# EAGLE design RTD_circuit (EAGLE 9.6.2)
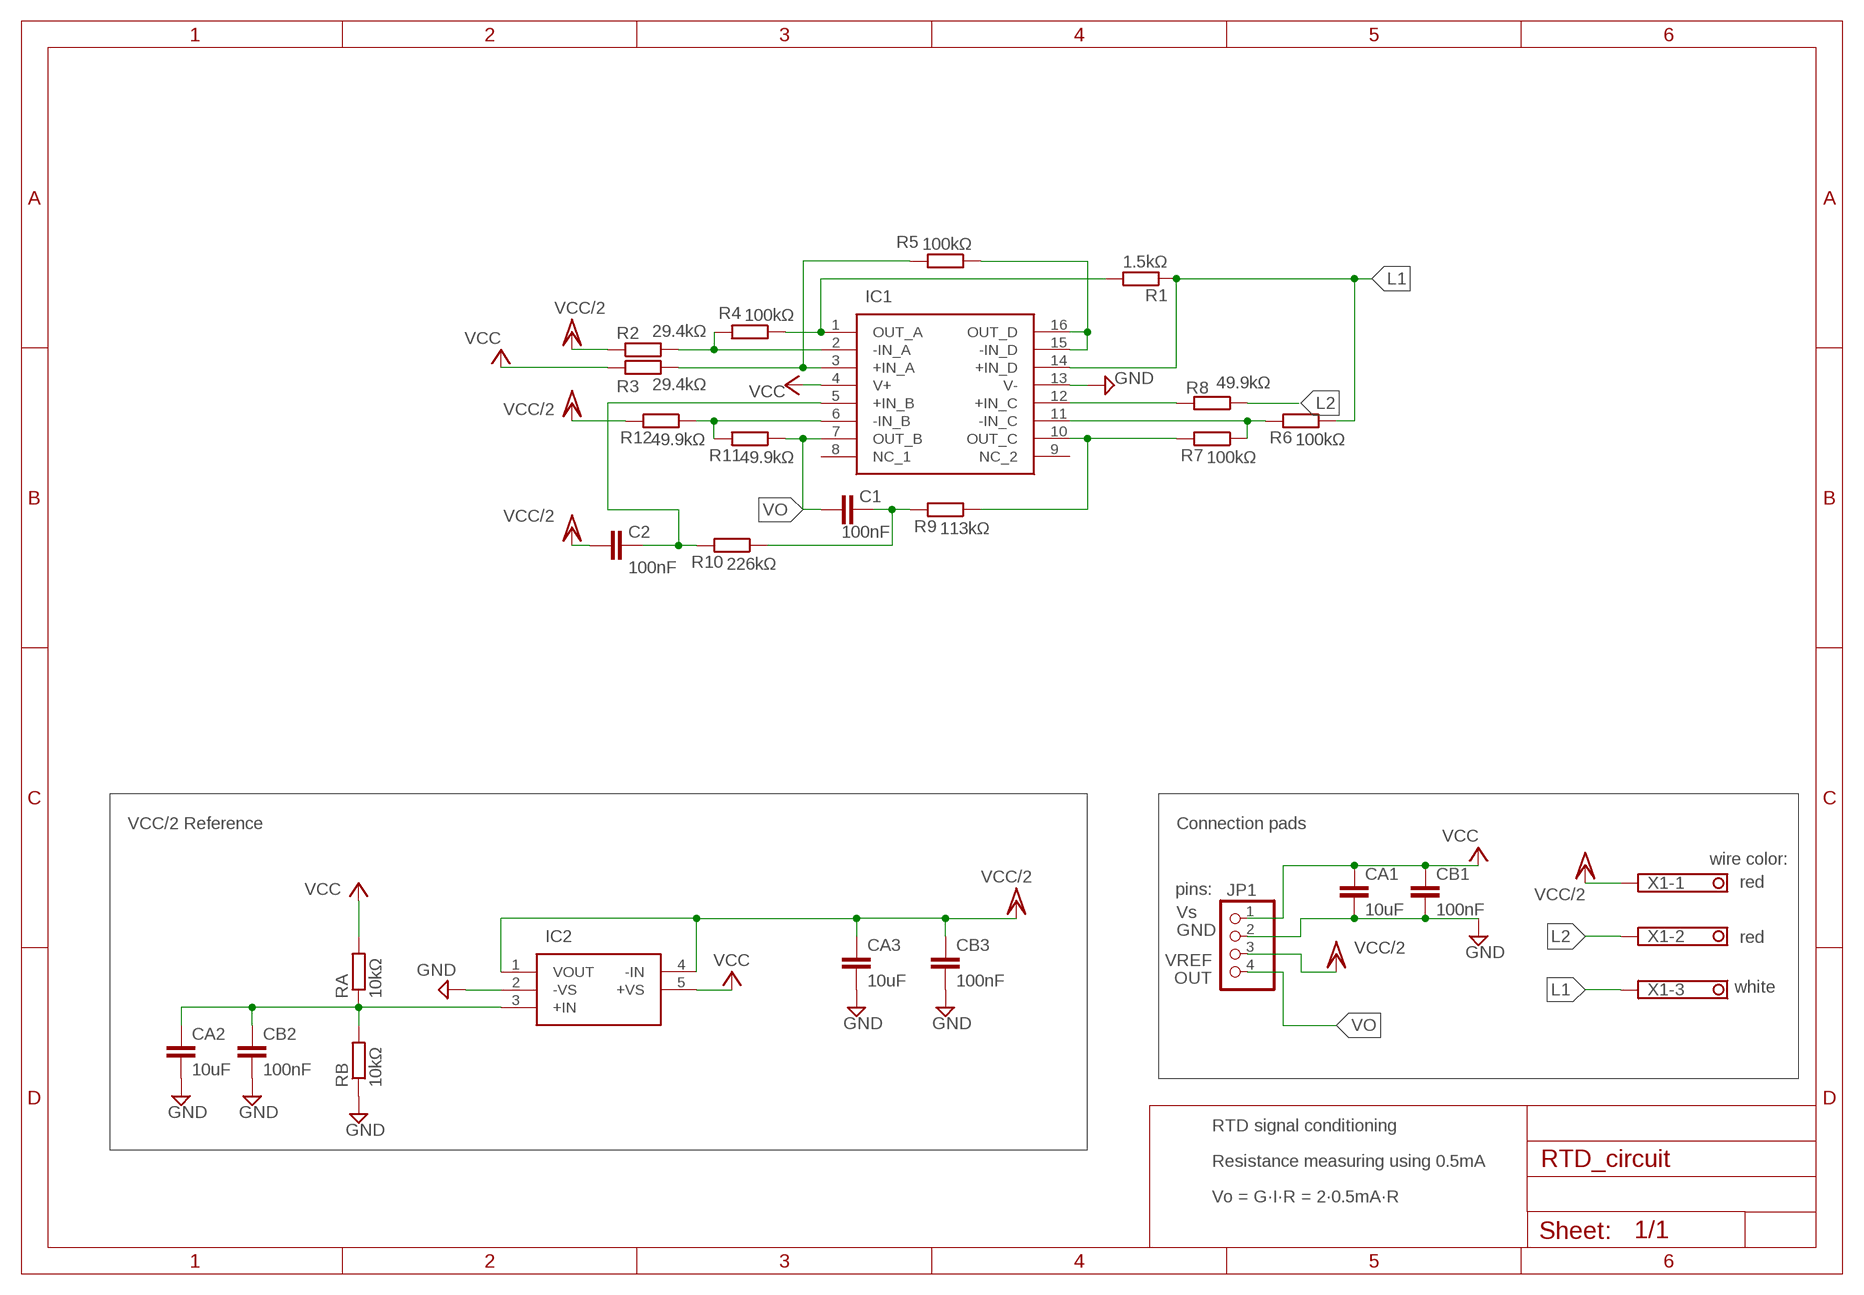
[diagram p0: schematic, sheet 1]

## Parts
C1  100nF  C-EUC0603  [C0603]
C2  100nF  C-EUC0603  [C0603]
CA1  10uF  C-EUC0603  [C0603]
CA2  10uF  C-EUC0603  [C0603]
CA3  10uF  C-EUC0603  [C0603]
CB1  100nF  C-EUC0603  [C0603]
CB2  100nF  C-EUC0603  [C0603]
CB3  100nF  C-EUC0603  [C0603]
IC1  LT1079SW#PBF  [SOIC127P1032X264-16N]
IC2  AD8031ARTZ-R2  [SOT95P280X145-5N]
JP1  PINHD-1X4  [1X04]
R1  1.5kΩ  R-EU_R0603  [R0603]
R2  29.4kΩ  R-EU_R0603  [R0603]
R3  29.4kΩ  R-EU_R0603  [R0603]
R4  100kΩ  R-EU_R0603  [R0603]
R5  100kΩ  R-EU_R0603  [R0603]
R6  100kΩ  R-EU_R0603  [R0603]
R7  100kΩ  R-EU_R0603  [R0603]
R8  49.9kΩ  R-EU_R0603  [R0603]
R9  113kΩ  R-EU_R0603  [R0603]
R10  226kΩ  R-EU_R0603  [R0603]
R11  49.9kΩ  R-EU_R0603  [R0603]
R12  49.9kΩ  R-EU_R0603  [R0603]
RA  10kΩ  R-EU_R0603  [R0603]
RB  10kΩ  R-EU_R0603  [R0603]
X1  1751251  [1751251]

## Nets
DIVIDER: CA2.1 CB2.1 IC2.3(+IN) RA.1 RB.2
GND: CA1.2 CA2.2 CA3.2 CB1.2 CB2.2 CB3.2 IC1.13(V-) IC2.2(-VS) JP1.2 RB.1
L1: IC1.14(+IN_D) R1.1 R6.1 X1.3
L2: R8.1 X1.2
N$1: IC1.12(+IN_C) R8.2
N$3: IC1.6(-IN_B) R11.2 R12.1
N$4: IC1.3(+IN_A) R3.2 R5.2
N$7: IC1.2(-IN_A) R2.2 R4.2
N$8: IC1.1(OUT_A) R1.2 R4.1
N$9: IC1.11(-IN_C) R6.2 R7.1
N$10: IC1.15(-IN_D) IC1.16(OUT_D) R5.1
N$11: IC1.10(OUT_C) R7.2 R9.1
N$12: C1.1 R9.2 R10.1
N$14: C2.1 IC1.5(+IN_B) R10.2
VCC: CA1.1 CB1.1 IC1.4(V+) IC2.5(+VS) JP1.1 R3.1 RA.2
VCC/2: C2.2 CA3.1 CB3.1 IC2.1(VOUT) IC2.4(-IN) JP1.3 R2.1 R12.2 X1.1
VO: C1.2 IC1.7(OUT_B) JP1.4 R11.1
Unconnected: IC1.8(NC_1) IC1.9(NC_2)

## Notes on the sheet
- VCC/2 Reference | Connection pads
- wire color:
- pins:
- red
- Vs
- GND
- red
- VREF
- OUT
- white
- RTD signal conditioning
- Resistance measuring using 0.5mA
- Vo = G·I·R = 2·0.5mA·R

## Library data of the parts
C1 C2 CA1-CA3 CB1-CB3 = rcl:C-EU: CAPACITOR, European symbol; SPICEPREFIX: C
IC1 = RTD_lib:LT1079SW#PBF: Linear Technology LT1079SW#PBF, Quad Precision Op Amp, 200kHz, 5 V, 16-Pin Source: Datasheet <https://componentsearchengine.com/Datasheets/2/LT1079SW#PBF.pdf>; DESCRIPTION: Linear Technology LT1079SW#PBF, Quad Precision Op Amp, 200kHz, 5 V, 16-Pin; HEIGHT: 2.642mm; MANUFACTURER_NAME: Linear Technology; MANUFACTURER_PART_NUMBER: LT1079SW#PBF; MOUSER_PART_NUMBER: 584-LT1079SW#PBF; MOUSER_PRICE-STOCK: https://www.mouser.co.uk/ProductDetail/Analog-Devices-Linear-Technology/LT1079SWPBF?qs=ytflclh7QUUhPHjSTuo8Sw%3D%3D
IC2 = RTD_lib:AD8031ARTZ-R2: Operational Amplifiers - Op Amps SOT23 SINGLE LOW POWER OP AMP 2.7 V, 800 uA, 80 MHz Rail-to-Rail I/O Amplifiers Source: Datasheet <https://www.analog.com/media/en/technical-documentation/data-sheets/AD8031_8032.pdf>; DESCRIPTION: Operational Amplifiers - Op Amps SOT23 SINGLE LOW POWER OP AMP 2.7 V, 800 uA, 80 MHz Rail-to-Rail I/O Amplifiers; HEIGHT: 1.45mm; MANUFACTURER_NAME: Analog Devices; MANUFACTURER_PART_NUMBER: AD8031ARTZ-R2; MOUSER_PART_NUMBER: 584-AD8031ARTZ-R2; MOUSER_PRICE-STOCK: https://www.mouser.co.uk/ProductDetail/Analog-Devices/AD8031ARTZ-R2?qs=Lds8L0UsNW6xZEKTQ5Dviw%3D%3D
JP1 = pinhead:PINHD-1X4: PIN HEADER
R1-R12 RA RB = rcl:R-EU_: RESISTOR, European symbol; SPICEPREFIX: R
X1 = con-phoenix-350:1751251: MKDS 1/ 3-3,5 Printklemme Nennstrom: 10 A Bemessungsspannung: 160 V Raster: 3,5 mm Polzahl: 3 Montageart: Löten Anschlussart: Schraubanschluss Anschlussrichtung vom Leiter zur Platine: 0° Source: http://eshop.phoenixcontact.com .. 1751251.pdf; OC_FARNELL: unknown; OC_NEWARK: unknown

## Board
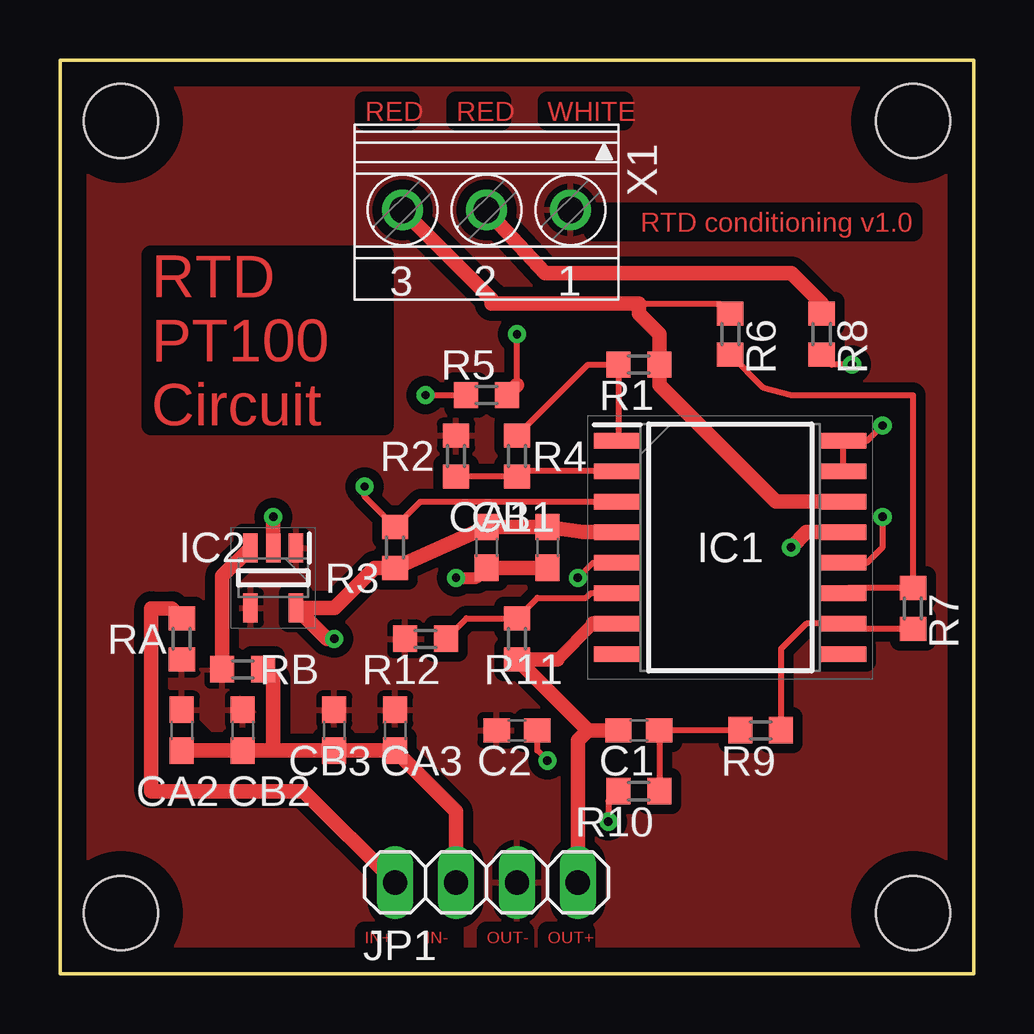
[diagram p1: board, top side]
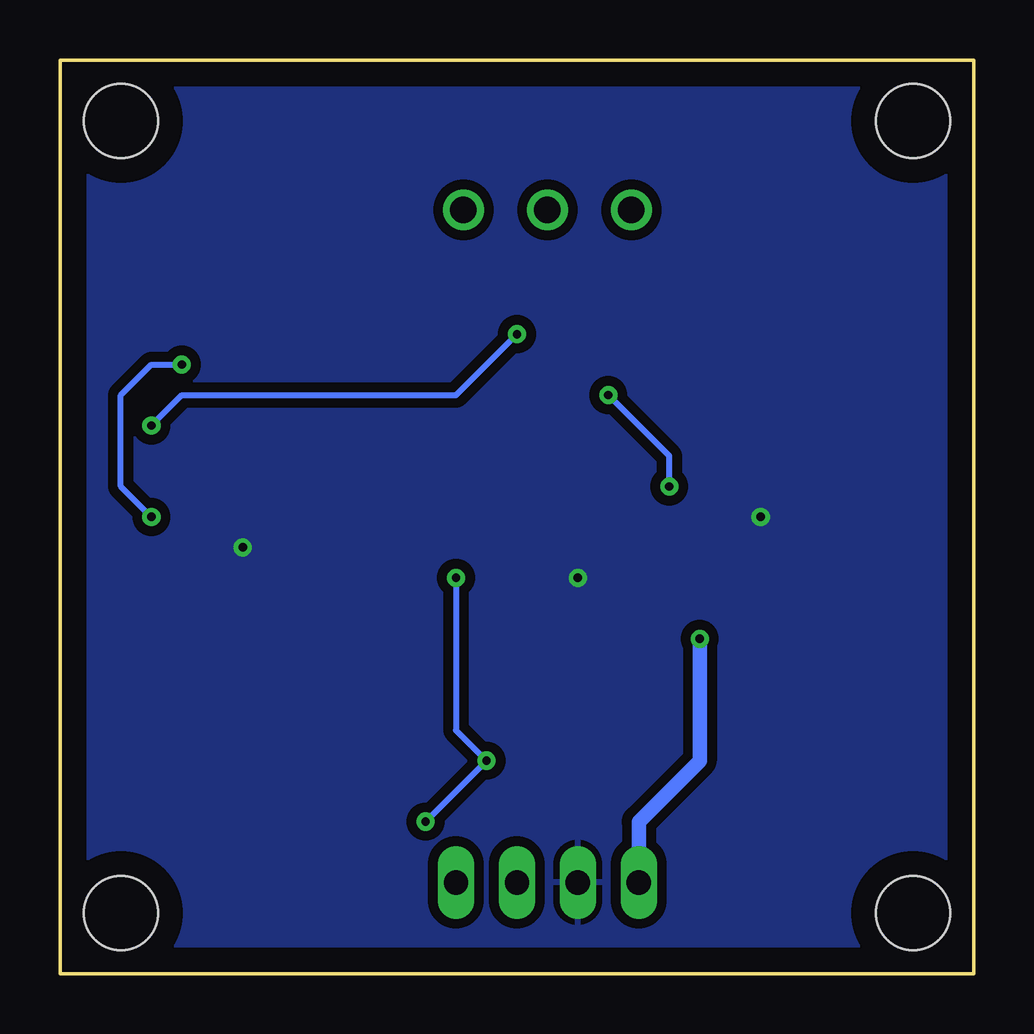
[diagram p2: board, bottom side, seen from below]

Size 38.1 x 38.1 mm. Coordinates in mm from the lower left corner, seen from the top.
Outline: 0,38.1 0,0 38.1,0 38.1,38.1 0,38.1
Copper layers (1*16): Top 0.035mm / dielectric 1.5mm / Bottom 0.035mm
Design rules "default *": minimum track width 1mil, minimum drill 0.35mm, track to track 6mil, track to pad 6mil, pad to pad 6mil, via to via 6mil, smd to smd 6mil, copper to edge 40mil, drill to drill 6mil, minimum pad ring 10mil, minimum via ring 8mil, stop-mask expansion 4mil, vias tented up to drill 0mil, thermal gap 10mil
Holes 3.1 mm at 2.54,35.56 2.54,2.54 35.56,35.56 35.56,2.54

### Footprints (pad centres in the part's own frame; a part is rotated, then mirrored left to right if it is on the bottom)
C0603 = smd 1.1 x 1: 1 -0.85,0; 2 0.85,0
SOIC127P1032X264-16N = smd 1.928 x 0.65: 1 -4.711,4.445; 2 -4.711,3.175; 3 -4.711,1.905; 4 -4.711,0.635; 5 -4.711,-0.635; 6 -4.711,-1.905; 7 -4.711,-3.175; 8 -4.711,-4.445; 9 4.711,-4.445; 10 4.711,-3.175; 11 4.711,-1.905; 12 4.711,-0.635; 13 4.711,0.635; 14 4.711,1.905; 15 4.711,3.175; 16 4.711,4.445
SOT95P280X145-5N = smd 1.2 x 0.6: 1 -1.25,0.95; 2 -1.25,0; 3 -1.25,-0.95; 4 1.25,-0.95; 5 1.25,0.95
1X04 = drill 1.016 long: 1 -3.81,0; 2 -1.27,0; 3 1.27,0; 4 3.81,0
R0603 = smd 1 x 1.1: 1 -0.85,0; 2 0.85,0
1751251 = drill 1.1 pad 1.7: 1 -3.5,-0.1; 2 0,-0.1; 3 3.5,-0.1

### Placement (x,y rotation side)
C1  24.13,10.16 180 top
C2  19.05,10.16 180 top
CA1  17.78,17.78 270 top
CA2  5.08,10.16 270 top
CA3  13.97,10.16 270 top
CB1  20.32,17.78 270 top
CB2  7.62,10.16 270 top
CB3  11.43,10.16 270 top
IC1  27.94,17.78 0 top
IC2  8.89,16.51 270 top
JP1  17.78,3.81 0 top
R1  24.13,25.4 180 top
R2  16.51,21.59 270 top
R3  13.97,17.78 90 top
R4  19.05,21.59 270 top
R5  17.78,24.13 180 top
R6  27.94,26.67 270 top
R7  35.56,15.24 270 top
R8  31.75,26.67 270 top
R9  29.21,10.16 180 top
R10  24.13,7.62 180 top
R11  19.05,13.97 90 top
R12  15.24,13.97 180 top
RA  5.08,13.97 90 top
RB  7.62,12.7 180 top
X1  17.78,31.75 180 top

### Tracks (layer width: path | path; a pad name or v marks a point on that pad's centre or on a via)
DIVIDER
  Top 0.61: RB.2 6.77,16.59 IC2.3
  pour Top (isolate 0.406, rank 3): 3.81,12.7 6.35,10.16 8.89,10.16 6.35,12.7
GND  (via drill 0.35)
  Top 0.508: v16.51,16.51 17.36,16.51 CA1.2
  Top 0.61: CA2.2 CB2.2 8.89,9.31 | 8.89,9.31 CB3.2 CA3.2 16.51,6.77 JP1.2 | RB.1 8.89,12.28 8.89,9.31 | CB1.2 CA1.2 | v8.89,19.05 IC2.2 | IC1.13 31.12,18.41 v30.48,17.78
  pour Bottom (isolate 0.406): 0,38.1 0,0 38.1,0 38.1,38.1
L1
  Top 0.152: 17.99,28.14 17.99,27.94
  Top 0.254: R6.1 27.52,27.94 24.13,27.94
  Top 0.61: 17.99,27.94 24.13,27.94 24.13,27.52 24.98,26.67 R1.1 24.98,24.55 29.84,19.68 IC1.14 | X1.3 17.99,28.14
L2
  Top 0.61: X1.2 20.22,29.21 30.48,29.21 31.75,27.94 R8.1
N$1  (via drill 0.35)
  Top 0.254: v34.29,19.05 34.29,17.78 33.66,17.14 IC1.12 | v33.02,25.4 32.17,25.4 R8.2
  Bottom 0.254: v34.29,19.05 35.56,20.32 35.56,24.13 34.29,25.4 v33.02,25.4
N$3
  Top 0.254: R12.1 16.94,14.82 R11.2 19.91,15.68 21.94,15.68 22.14,15.88 IC1.6
N$4  (via drill 0.35)
  Top 0.254: IC1.3 15.03,19.68 R3.2 12.7,19.9 v12.7,20.32 | v15.24,24.13 R5.2
  Bottom 0.254: v12.7,20.32 12.7,21.59 v15.24,24.13
N$7
  Top 0.254: IC1.2 19.27,20.96 R4.2 R2.2
N$8
  Top 0.254: R4.1 22.01,25.4 R1.2 23.28,22.28
  Top 0.61: IC1.1 23.28,22.28
N$9
  Top 0.254: R6.2 29.31,24.45 30.48,24.13 35.56,24.13 R7.1 32.87,16.09 IC1.11
N$10  (via drill 0.35)
  Top 0.254: IC1.15 IC1.16 33.66,22.23 v34.29,22.86 | 19.05,24.55 v19.05,26.67
  Top 0.61: R5.1 19.05,24.55
  Bottom 0.254: v34.29,22.86 33.02,24.13 21.59,24.13 v19.05,26.67
N$11
  Top 0.254: R9.1 30.06,13.55 31.12,14.61 IC1.10 32.87,14.39 R7.2
N$12
  Top 0.254: R9.2 C1.1 R10.1
N$14  (via drill 0.35)
  Top 0.254: R10.2 22.86,7.2 v22.86,6.35 | v20.32,8.89 19.9,9.31 C2.1 | v21.59,16.51 22.23,17.14 IC1.5
  Bottom 0.254: v22.86,6.35 v20.32,8.89 21.59,10.16 v21.59,16.51
VCC  (via drill 0.35)
  Top 0.61: IC1.4 21.8,18.41 CB1.1 CA1.1 R3.1 13.12,16.93 11.45,15.26 IC2.5 11.13,13.97 v11.43,13.97 | JP1.1 10.16,7.62 3.81,7.62 3.81,15.24 4.66,15.24 RA.2
  Bottom 0.61: v11.43,13.97 11.43,8.89 13.97,6.35 JP1.1
VCC/2
  pour Top (isolate 0.406, rank 4): 0,38.1 0,0 38.1,0 38.1,38.1
VO
  Top 0.508: 22.23,14.61 20.74,13.12
  Top 0.61: IC1.7 22.23,14.61 | 20.74,13.12 R11.1 22.01,10.16 | C1.2 22.01,10.16 | JP1.4 21.59,9.74 22.01,10.16

### Text on the board
Top: RED | RED | WHITE | RTD conditioning v1.0 | RTD / PT100 / Circuit | IN+ | IN- | OUT- | OUT+